# EAGLE design untitled (EAGLE 7.1.0)
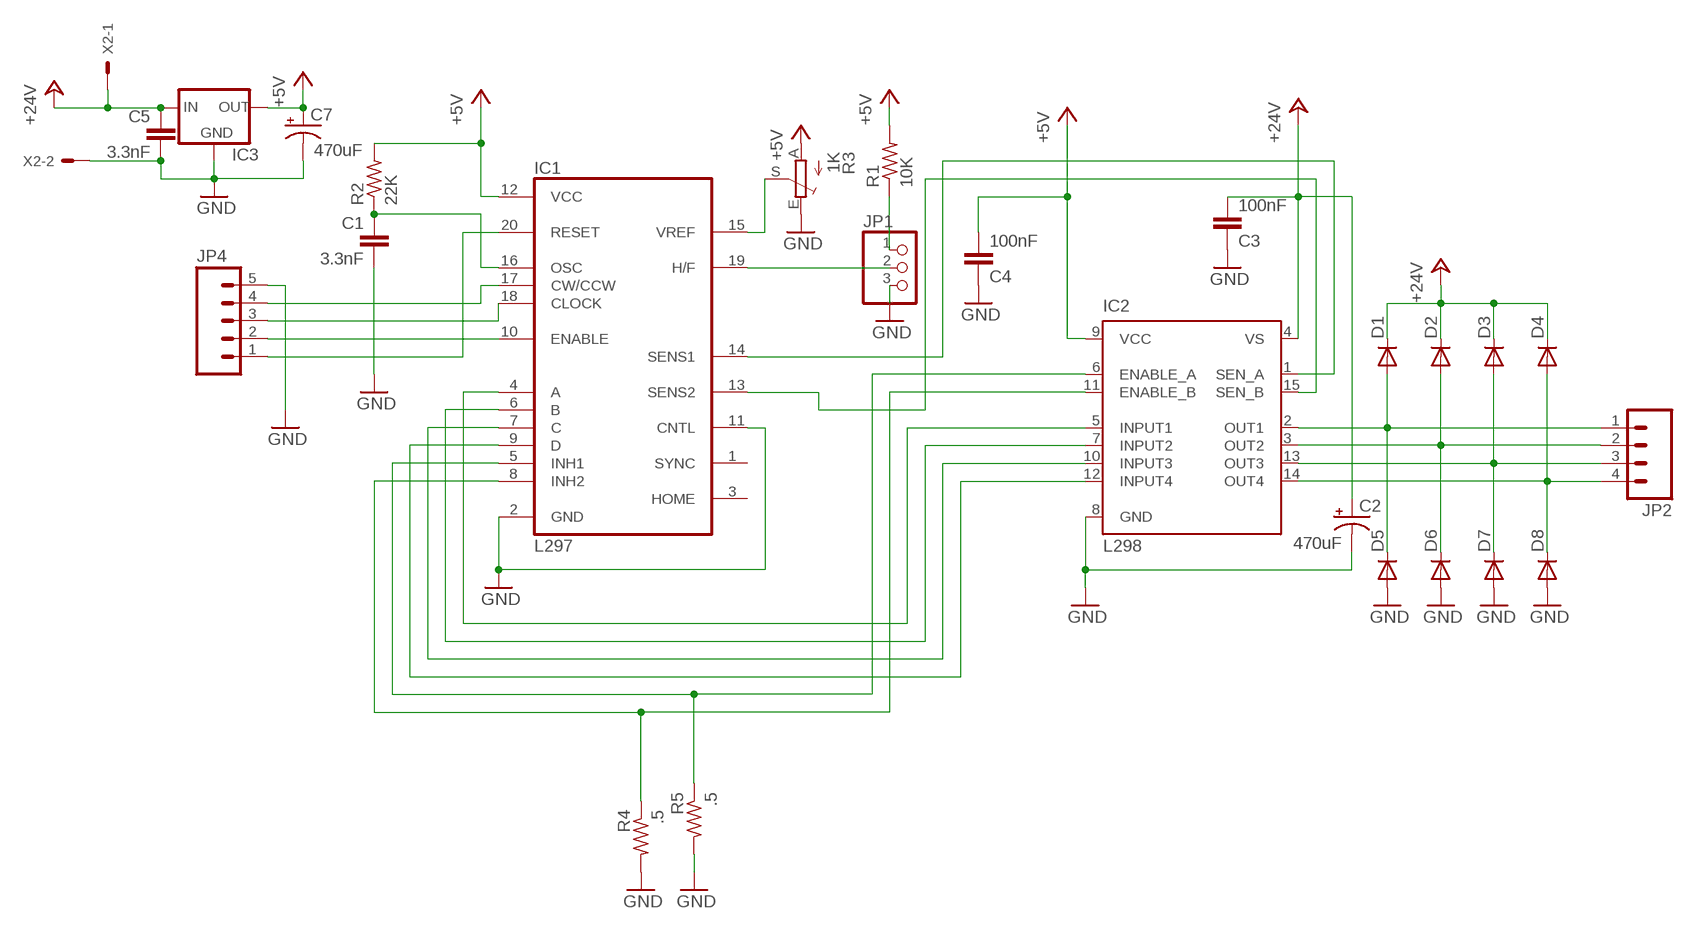
[diagram p0: schematic, sheet 1]

## Parts
C1  3.3nF  C2,5-3  [C2.5-3]
C2  470uF  CAP_POLPTH1  [CPOL-RADIAL-100UF-25V]
C3  100nF  C2,5-3  [C2.5-3]
C4  100nF  C2,5-3  [C2.5-3]
C5  3.3nF  C2,5-3  [C2.5-3]
C7  470uF  CAP_POLPTH1  [CPOL-RADIAL-100UF-25V]
D1  DIODE-DO201-15  [DO201-15]
D2  DIODE-DO201-15  [DO201-15]
D3  DIODE-DO201-15  [DO201-15]
D4  DIODE-DO201-15  [DO201-15]
D5  DIODE-DO201-15  [DO201-15]
D6  DIODE-DO201-15  [DO201-15]
D7  DIODE-DO201-15  [DO201-15]
D8  DIODE-DO201-15  [DO201-15]
IC1  L297  [DIL20]
IC2  L298  [MULTIWATT-15]
IC3  V_REG_78XXSINK  [TO220-IGO]
JP1  PINHD-1X3  [1X03]
JP2  M04PTH  [1X04]
JP4  M05PTH  [1X05]
R1  10K  R-US_0207/10  [0207/10]
R2  22K  R-US_0207/10  [0207/10]
R3  1K  TRIM_EU-B64Y  [B64Y]
R4  .5  R-US_0617/22  [0617/22]
R5  .5  R-US_0617/22  [0617/22]
X2  KK-156-2  [KK-156-2]

## Nets
+5V: C4.2 C7.1(+) IC1.12(VCC) IC2.9(VCC) IC3.OUT R1.2 R2.2 R3.A
+24V: C2.1(+) C3.2 C5.1 D1.C D2.C D3.C D4.C IC2.4(VS) IC3.IN X2.1
GND: C1.2 C2.2(-) C3.1 C4.1 C5.2 C7.2(-) D5.A D6.A D7.A D8.A IC1.2(GND) IC1.11(CNTL) IC2.8(GND) IC3.GND JP1.3 JP4.5 R3.E R4.2 R5.2 X2.2
N$1: IC1.15(VREF) R3.S
N$2: JP1.1 R1.1
N$3: D1.A D5.C IC2.2(OUT1) JP2.1
N$4: D2.A D6.C IC2.3(OUT2) JP2.2
N$5: IC1.5(INH1) IC2.6(ENABLE_A) R5.1
N$6: IC1.8(INH2) IC2.11(ENABLE_B) R4.1
N$7: IC1.19(H/F) JP1.2
N$8: IC1.13(SENS2) IC2.15(SEN_B)
N$9: IC1.14(SENS1) IC2.1(SEN_A)
N$10: IC1.10(ENABLE) JP4.2
N$11: IC1.18(CLOCK) JP4.3
N$12: IC1.17(CW/CCW) JP4.4
N$13: IC1.20(RESET) JP4.1
N$14: IC1.4(A) IC2.5(INPUT1)
N$15: IC1.6(B) IC2.7(INPUT2)
N$16: IC1.7(C) IC2.10(INPUT3)
N$17: IC1.9(D) IC2.12(INPUT4)
N$18: D3.A D7.C IC2.13(OUT3) JP2.3
N$19: D4.A D8.C IC2.14(OUT4) JP2.4
N$20: C1.1 IC1.16(OSC) R2.1
Unconnected: IC1.1(SYNC) IC1.3(HOME)

## Library data of the parts
C1 C3-C5 = capacitor-wima:C: CAPACITOR naming: grid - package width
C2 C7 = SparkFun-Capacitors:CAP_POL: Capacitor Polarized These are standard SMD and PTH capacitors. Normally 10uF, 47uF, and 100uF in electrolytic and tantalum varieties. Always verify the external diameter of the through hole cap, it varies with capacity, voltage, and manufacturer. The EIA devices should be standard.
D1-D8 = diode:DIODE-: DIODE
IC1 = st-microelectronics:L297: STEPPER MOTOR CONTROLLER; MPN: L297/1; OC_FARNELL: 1094209; OC_NEWARK: 56P8258
IC2 = st-microelectronics:L298: DUAL FULL-BRIDGE DRIVER; MPN: L298N; OC_FARNELL: 1589425; OC_NEWARK: 32M1527
IC3 = SparkFun-PowerIC:V_REG_78XX: Voltage Regulator Standard 7805 5V regulator. IGO (Input Ground Output). Spark Fun Electronics SKU : COM-00107
JP1 = pinhead:PINHD-1X3: PIN HEADER
JP2 = SparkFun-Connectors:M04: Header 4 Standard 4-pin 0.1" header. Use with straight break away headers (SKU : PRT-00116), right angle break away headers (PRT-00553), swiss pins (PRT-00743), machine pins (PRT-00117), and female headers (PRT-00115). Molex polarized connector foot print use with SKU : PRT-08231 with associated crimp pins and housings. 1MM SMD Version SKU: PRT-10208
JP4 = SparkFun-Connectors:M05: Header 5 Standard 5-pin 0.1" header. Use with straight break away headers (SKU : PRT-00116), right angle break away headers (PRT-00553), swiss pins (PRT-00743), machine pins (PRT-00117), and female headers (PRT-00115). Molex polarized connector foot print use with SKU : PRT-08230 with associated crimp pins and housings.
R1 R2 R4 R5 = resistor:R-US_: RESISTOR, American symbol
R3 = pot:TRIM_EU-: POTENTIOMETER
X2 = con-molex:KK-156-2: KK 156 HEADER Source: http://www.molex.com/pdm_docs/sd/026604100_sd.pdf; OC_FARNELL: unknown; OC_NEWARK: unknown

## Board
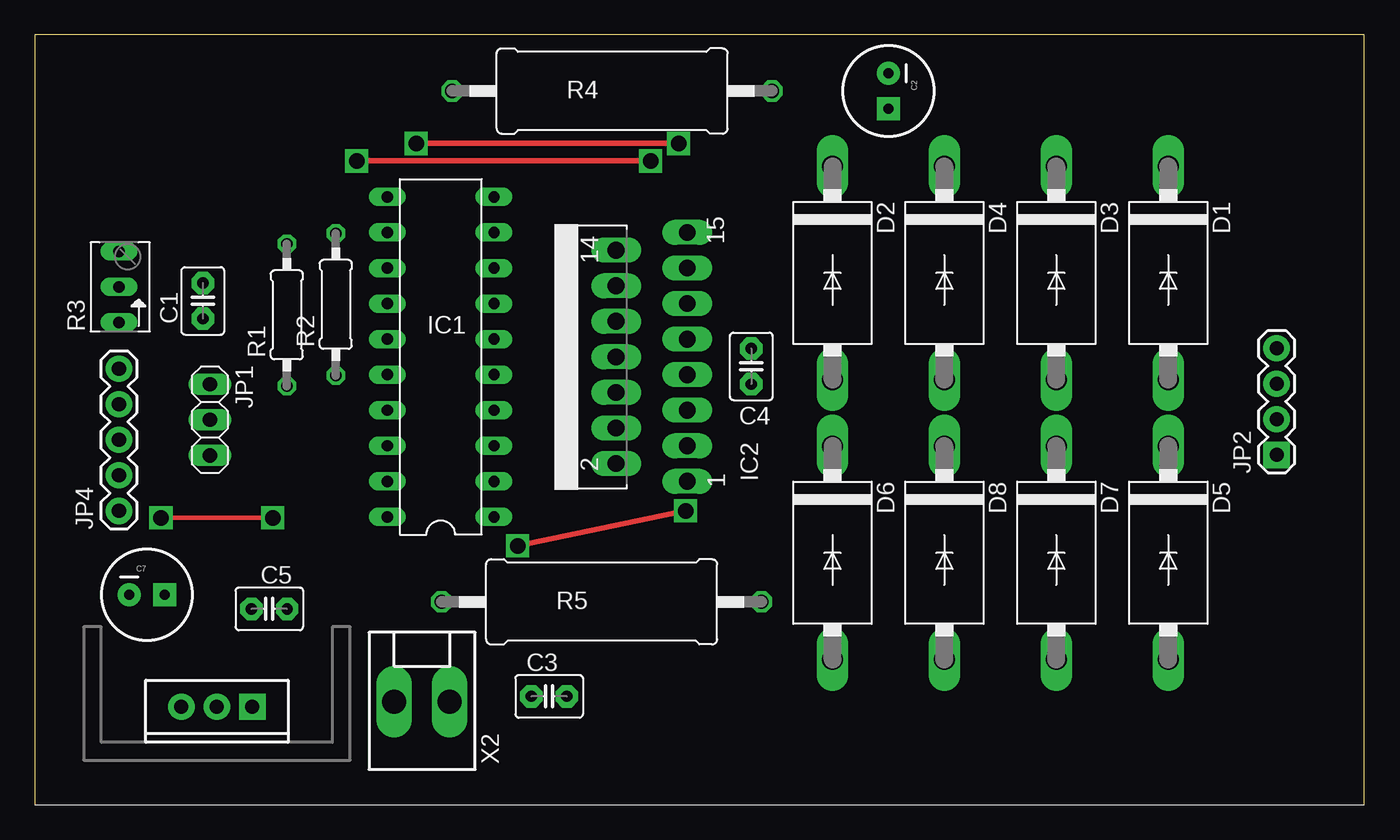
[diagram p1: board, top side]
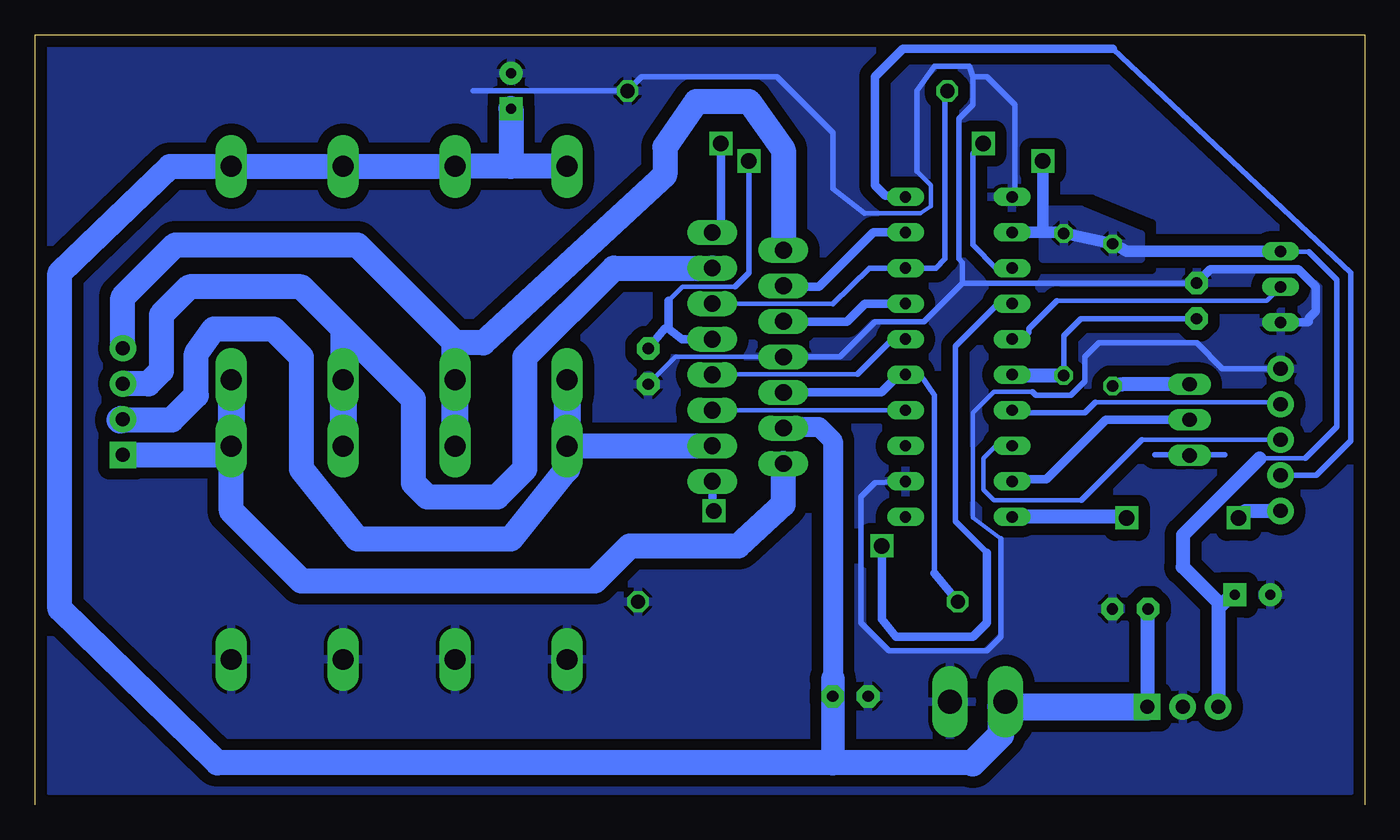
[diagram p2: board, bottom side, seen from below]

Size 95 x 55 mm. Coordinates in mm from the lower left corner, seen from the top.
Outline: 95,0 95,55 0,55 0,0
Copper layers (1*16): Top 0.035mm / dielectric 1.5mm / Bottom 0.035mm
Design rules "default *": minimum track width 12mil, minimum drill 12mil, track to track 12mil, track to pad 8mil, pad to pad 12mil, via to via 12mil, smd to smd 8mil, copper to edge 30mil, drill to drill 8mil, minimum pad ring 10mil, minimum via ring 8mil, stop-mask expansion 4mil, vias tented up to drill 0mil, thermal gap 10mil

### Footprints (pad centres in the part's own frame; a part is rotated, then mirrored left to right if it is on the bottom)
C2.5-3 = drill 0.813 pad 1.6 octagon: 1 -1.27,0; 2 1.27,0
CPOL-RADIAL-100UF-25V = drill 0.7 pad 1.651 square: 1 1.27,0 | drill 0.7 pad 1.651: 2 -1.27,0
DO201-15 = drill 1.499 long: A 7.62,0; C -7.62,0
DIL20 = drill 0.813 long: 1 -11.43,-3.81; 2 -8.89,-3.81; 3 -6.35,-3.81; 4 -3.81,-3.81; 5 -1.27,-3.81; 6 1.27,-3.81; 7 3.81,-3.81; 8 6.35,-3.81; 9 8.89,-3.81; 10 11.43,-3.81; 11 11.43,3.81; 12 8.89,3.81; 13 6.35,3.81; 14 3.81,3.81; 15 1.27,3.81; 16 -1.27,3.81; 17 -3.81,3.81; 18 -6.35,3.81; 19 -8.89,3.81; 20 -11.43,3.81
MULTIWATT-15 = drill 1.2 long: 1 -8.89,-7.62; 2 -7.62,-2.54; 3 -6.35,-7.62; 4 -5.08,-2.54; 5 -3.81,-7.62; 6 -2.54,-2.54; 7 -1.27,-7.62; 8 0,-2.54; 9 1.27,-7.62; 10 2.54,-2.54; 11 3.81,-7.62; 12 5.08,-2.54; 13 6.35,-7.62; 14 7.62,-2.54; 15 8.89,-7.62
TO220-IGO = drill 1 pad 1.88: GND 0,0; OUT 2.54,0 | drill 1 pad 1.88 square: IN -2.54,0
1X03 = drill 1.016 long: 1 -2.54,0; 2 0,0; 3 2.54,0
1X04 = drill 1.016 pad 1.88 square: 1 0,0 | drill 1.016 pad 1.88: 2 2.54,0; 3 5.08,0; 4 7.62,0
1X05 = drill 1.016 pad 1.88: 1 0,0; 2 2.54,0; 3 5.08,0; 4 7.62,0; 5 10.16,0
0207/10 = drill 0.813 octagon: 1 -5.08,0; 2 5.08,0
B64Y = drill 0.813 long: A 2.54,0; E -2.54,0; S 0,0
0617/22 = drill 1.016 octagon: 1 -11.43,0; 2 11.43,0
KK-156-2 = drill 1.7 pad 2.184 long: 1 -1.98,0; 2 1.98,0

### Placement (x,y rotation side)
C1  12,36 90 top
C2  61,51 270 top
C3  36.75,7.75 0 top
C4  51.2,31.32 90 top
C5  16.75,14 0 top
C7  8,15 0 top
D1  81,38 270 top
D2  57,38 270 top
D3  73,38 270 top
D4  65,38 270 top
D5  81,18 270 top
D6  57,18 270 top
D7  73,18 270 top
D8  65,18 270 top
IC1  29,32 90 top
IC2  39,32 90 top
IC3  13,7 180 top
JP1  12.5,27.5 270 top
JP2  88.75,25 90 top
JP4  6,21 90 top
R1  18,35 90 top
R2  21.5,35.75 90 top
R3  6,37 90 top
R4  41.25,51 0 top
R5  40.5,14.5 0 top
X2  27.66,7.36 0 top

### Tracks (layer width: path | path; a pad name or v marks a point on that pad's centre or on a via)
+5V  (via drill 1.1)
  Top 0.406: v44,46 v23,46
  Bottom 0.305: 4.25,24.75 7.5,24.75 | R3.A 5.96,39.5 4,39.5 | 49.75,36 48.75,37 45,37 | 49.75,34 50.04,34 | 10.46,14.46 10.25,14.25
  Bottom 0.406: 4.25,24.75 2,27 2,37.5 4,39.5 | IC1.12 24.58,40.89 | 45,37 44,38 v44,46 | R2.2 21.56,40.89
  Bottom 0.61: IC2.9 48.77,33.27 49.75,34 49.75,36 | 50.04,34 C4.2 | C7.1 9.5,15
  Bottom 0.813: R3.A 17,39.54 R1.2 R2.2 | 21.56,40.89 23,40.89 | 23,40.89 IC1.12 | v23,46 23,40.89
  Bottom 1.016: 7.5,24.75 12.98,19.27 13,17 10.46,14.46 IC3.OUT | 9.5,15 10.25,14.25
  pour Bottom: 16,39 16,40.75 20.25,42.5 23,42.5 23,39
+24V
  Bottom 0.305: IC2.4 41.54,27 | C3.2 38.25,9.25 38,9 | IC3.IN 15.48,7.06
  Bottom 1.016: 15.48,7.06 C5.1
  Bottom 1.422: 41.54,27 39,27 38,26 38,9
  Bottom 1.676: 38,9 38,3
  Bottom 1.778: D2.C 61,45.62 | 61,45.62 D4.C D3.C D1.C 85.38,45.62 93.25,38 93.25,14 82,3 38,3 28,3 | C2.1 61,45.62
  Bottom 1.93: 28,3 26,5 26,7.04 X2.1 25.32,7 IC3.IN
GND
  Bottom 0.305: 23.75,29.5 26.5,29.5 28,28 28,20.5 26,19 | 32,45.25 31,44.25 31,42.75 31.75,42.25 35.75,42.25 | IC2.8 49.25,32 C4.1
  Bottom 0.406: C1.2 28.73,37.27 | JP4.5 10.16,31.16 12,33 19,33 20,32 20,30.25 21,29.25 23.5,29.25 23.75,29.5 | 32,45.25 32,51 30.75,52.75 28.25,52.75 28,52 | 28.73,37.27 31.5,34.5 35,34.5 37.5,32 IC2.8 | 35.75,42.25 38,44 38,48 42,52 51.68,52 R4.2 63.73,51 | 28.73,37.27 28.73,38.73 29,39 29,49 28,50 28,52 | 26,19 26,12 27,11 34,11 36,13 36,22 35,23 IC1.2 | IC1.11 25,43.62 25,50 27,52 28,52
  Bottom 0.61: C1.2 11.02,38.25 4.75,38.25 3.5,37 3.5,35.25 4,34.75 4,34.5 4.04,34.46 R3.E
  pour Bottom (isolate 0.813, rank 2): 1,54 1,1 94,1 94,54
N$1
  Bottom 0.305: R3.S 7,36 22,36 | 25.17,33.25 IC1.15
  Bottom 0.406: 22,36 24,34 24,33.75 24.5,33.25 25.17,33.25
N$2
  Bottom 1.016: JP1.1 17.35,30.04 R1.1
N$3
  Bottom 1.778: IC2.2 41.54,21.46 44.75,18.5 52.5,18.5 55,16 76,16 81,21 D5.C | JP2.1 81,25
  Bottom 1.93: D1.A D5.C 81,25
N$4
  Bottom 0.305: IC2.3 46.65,25.62
  Bottom 1.778: 88.96,27.5 85.25,27.5 83.5,29.25 83.5,32.25 82.25,34 78,34 76,32 76,24 72,19 61,19 57,24 | 46.65,25.62 D6.C
  Bottom 1.93: D2.A D6.C 57,24 | JP2.2 88.96,27.5
N$5
  Bottom 0.406: 30.75,16.55 30.75,29.25 31.73,30.73 IC1.5 33.27,30.73
  Bottom 0.61: 30.75,16.55 R5.1 | 33.27,30.73 34.54,29.46 IC2.6
N$6
  Bottom 0.305: IC2.11 46,35.81 45.99,35.8 38,35.8 | R4.1 arc90 30,50.93
  Bottom 0.406: 38,35.8 35.4,38.35 IC1.8 30.65,38.35 30,39 30,50.93
N$7
  Bottom 0.305: 25.08,23 IC1.19 25.05,23.25
  Bottom 0.61: JP1.2 18.5,27.5 22.75,23.25 25.05,23.25
N$8  (via drill 1.1)
  Top 0.406: v27.25,47.25 v46,47.25
  Bottom 0.406: v27.25,47.25 28,46.5 28,40 26.35,38.35 IC1.13
  Bottom 0.61: IC2.15 46,41.51 v46,47.25
N$9  (via drill 1.1)
  Top 0.406: v34.5,18.5 v46.5,21
  Bottom 0.406: IC1.14 26.19,35.81 29.25,32.75 29.25,20.25 27,18
  Bottom 0.61: 27,18 27,13 28,12 33.5,12 34.5,13.25 v34.5,18.5 | IC2.1 46.62,21.62 v46.5,21
N$10
  Bottom 0.406: IC1.10 33,43.62 | 18,54 1,38 1,26 3.46,23.54 JP4.2
  Bottom 0.61: 18,54 33,54 35,52 35,44.25 34.25,43.5 32.88,43.5 IC1.10
N$11
  Bottom 0.305: 20.25,21.75 26.5,21.75 27.25,22.5 27.25,24.75 26.35,25.65 IC1.18 | JP4.3 15.92,26.08
  Bottom 0.406: 15.92,26.08 20.25,21.75
N$12
  Bottom 0.305: JP4.4 6.13,28.75 19.25,28.75 | 25,28 IC1.17
  Bottom 0.406: 19.25,28.75 20,28 25,28
N$13  (via drill 1.1)
  Top 0.305: v9,20.5 v17,20.5
  Bottom 0.305: v17,20.5 17.07,20.57
  Bottom 1.016: 17.07,20.57 IC1.20 | v9,20.5 8.5,21 JP4.1
N$14
  Bottom 0.305: IC1.4 IC2.5
N$15
  Bottom 0.305: 36.25,30.75 46.6,30.75 IC2.7
  Bottom 0.406: IC1.6 33.73,33.27 36.25,30.75
N$16
  Bottom 0.305: 41.5,34.5 IC2.10
  Bottom 0.61: IC1.7 35.69,35.81 37,34.5 41.5,34.5
N$17
  Bottom 0.305: 41.46,37 IC2.12
  Bottom 0.61: IC1.9 35.11,40.89 39,37 41.46,37
N$18
  Bottom 1.778: D3.A 73,34 | 73,34 76,37 84,37 86,35 86,31 86.92,30.08 JP2.3 | 73,34 68,29 68,23 67,22 62,22 60,24 60,32 53.65,38.35 IC2.13
  Bottom 1.93: D3.A D7.C
N$19
  Bottom 1.778: JP2.4 88.75,36.25 85,40 72,40 65,33 63,33 50,45 50,47 47.75,50.25 44,50.25 41.54,46.79 IC2.14
  Bottom 1.93: D8.C D4.A 65,33
N$20
  Bottom 0.305: 25.17,30.75 IC1.16
  Bottom 0.406: C1.1 20.27,34.73 21.5,33.5 R2.1 | 25.13,30.67 IC1.16
  Bottom 1.016: R2.1 25.13,30.67
N$22
  Bottom 0.406: 10,25 15,25